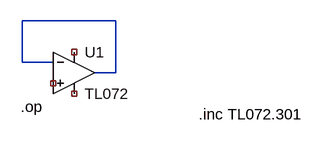
[diagram p0: schematic Opamp_Txt.asc]
Opamp_Txt.asc, the LTspice schematic file:
Version 4
SHEET 1 1080 1264
WIRE 192 48 48 48
WIRE 48 112 48 48
WIRE 96 112 48 112
WIRE 192 128 192 48
WIRE 192 128 160 128
SYMBOL Opamps\\opamp2 128 64 R0
SYMATTR InstName U1
SYMATTR Value TL072
TEXT 46 180 Left 2 !.op
TEXT 320 192 Left 2 !.inc TL072.301

The netlist it stands for:
* Opamp_Txt.asc
XU1 NC_01 N001 NC_02 NC_03 N001 TL072  ; pins In+ In- V+ V- OUT
.op
.inc TL072.301
.backanno
.end